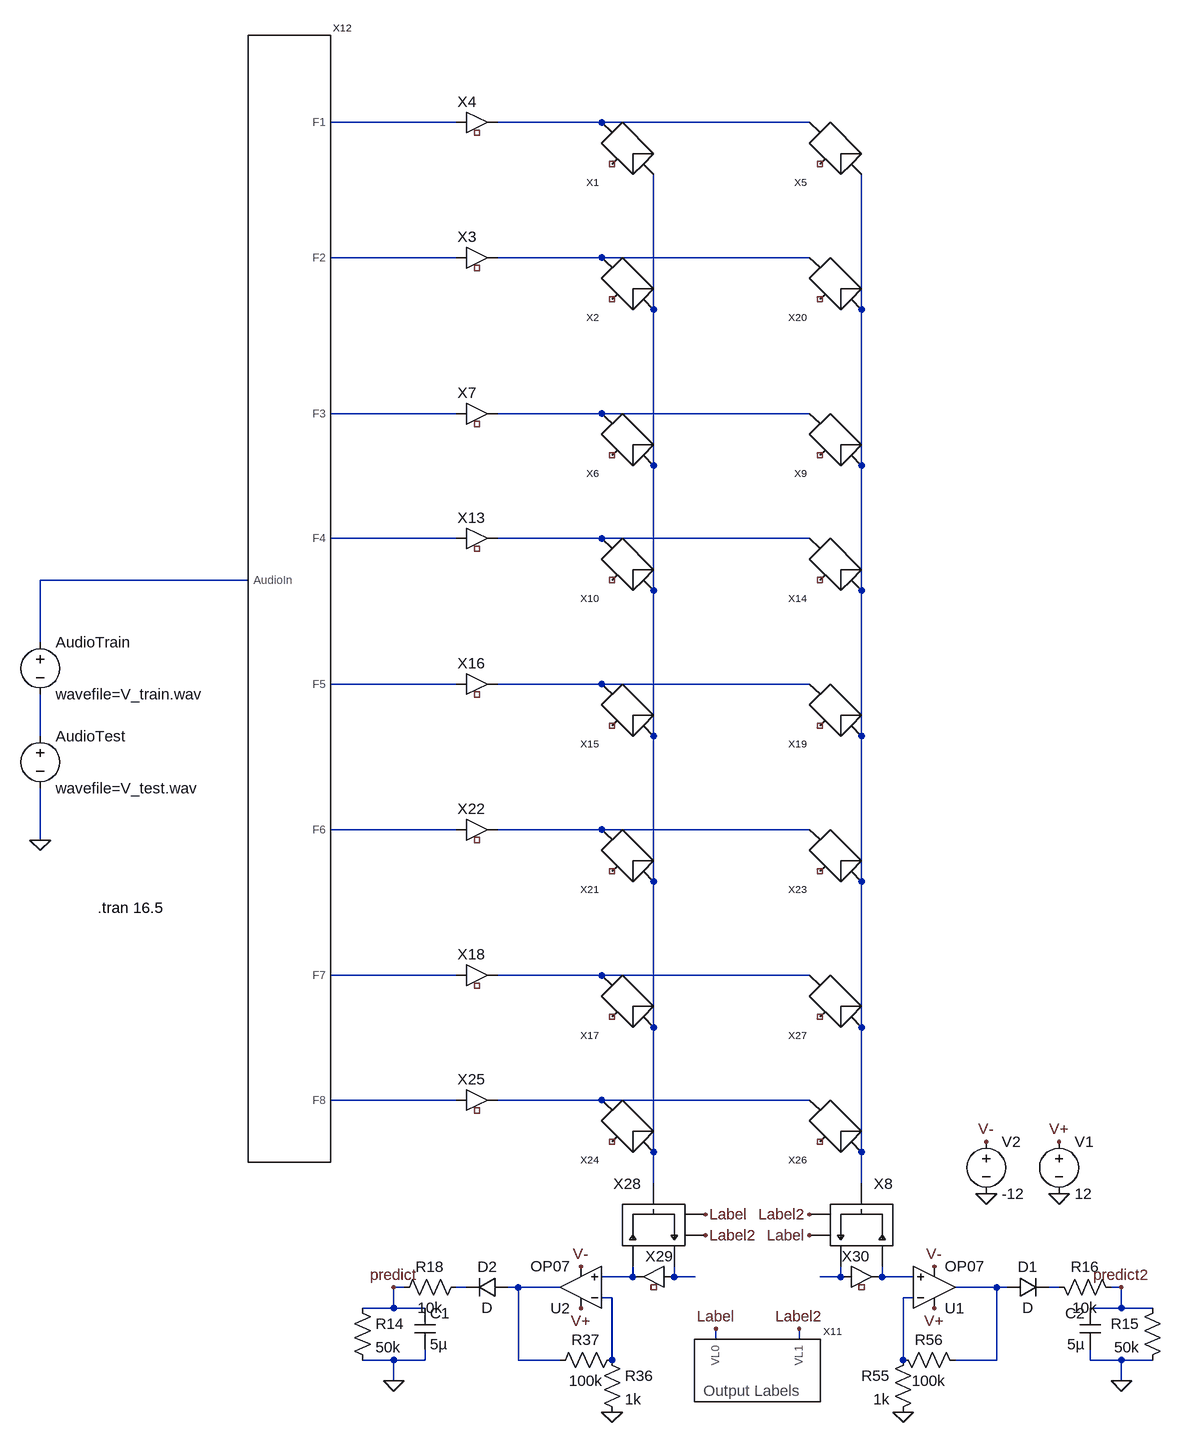
[diagram p0: schematic Net Array_Small.asc]
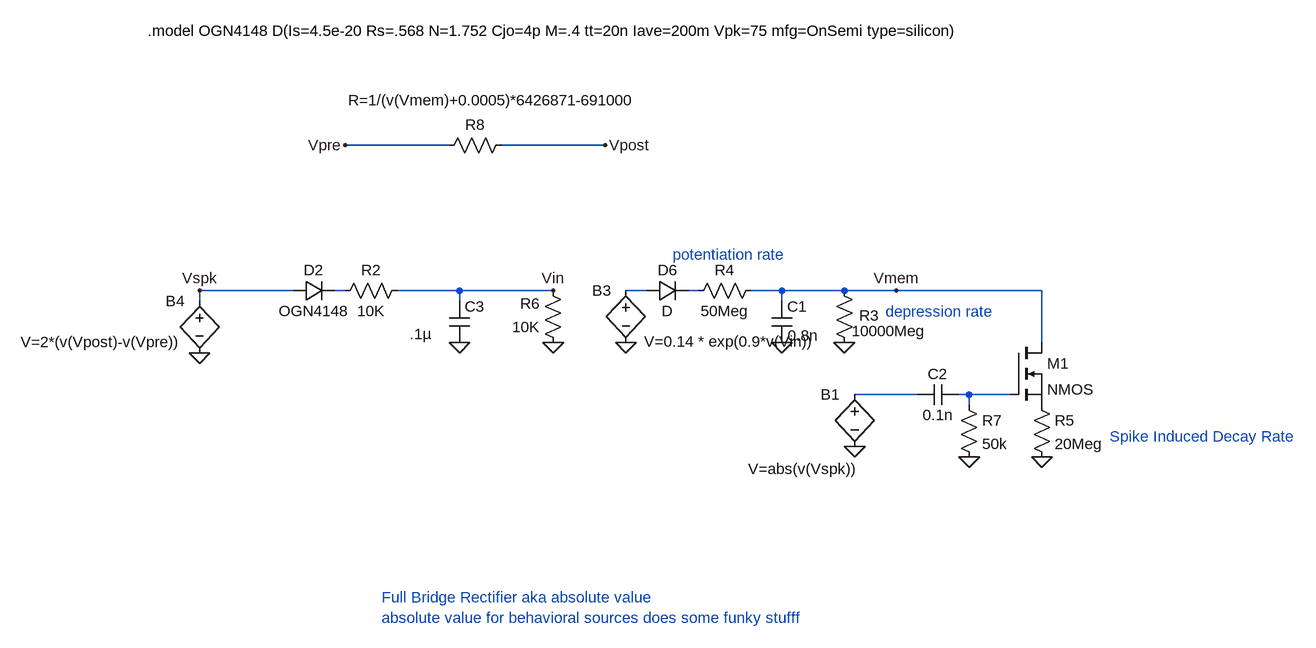
[diagram p1: sub-circuit synapse.asc]
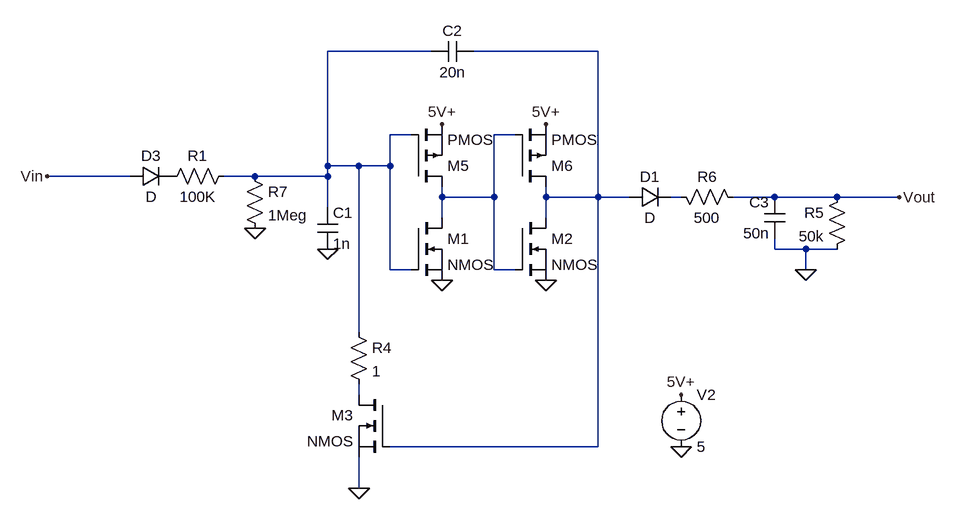
[diagram p2: sub-circuit ahp.asc]
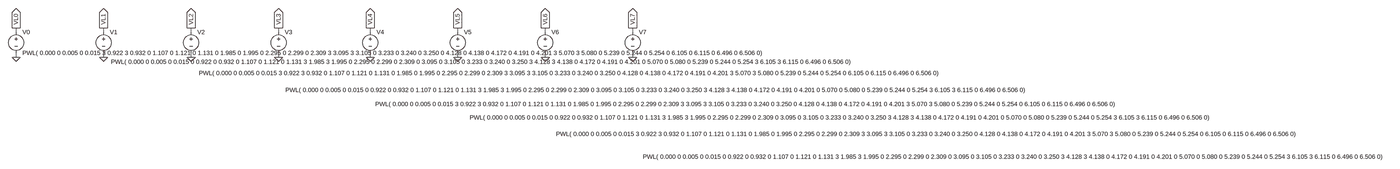
[diagram p3: sub-circuit outputlabels.asc, whole sheet]
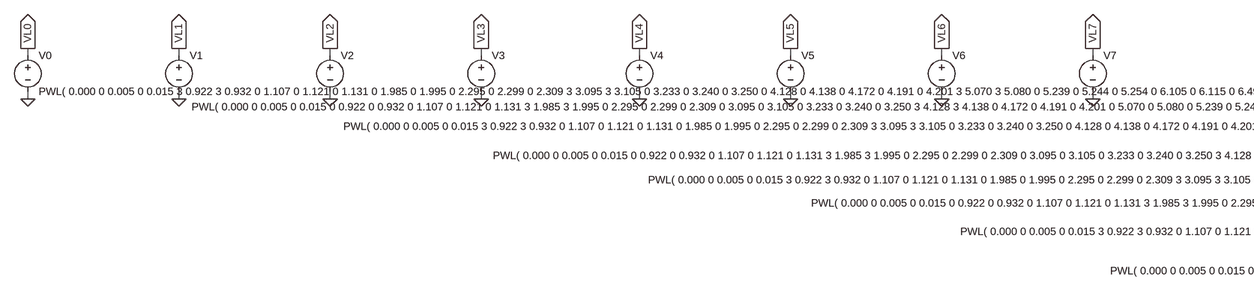
[diagram p4: sub-circuit outputlabels.asc, part, row 1 of 1, column 1 of 2]
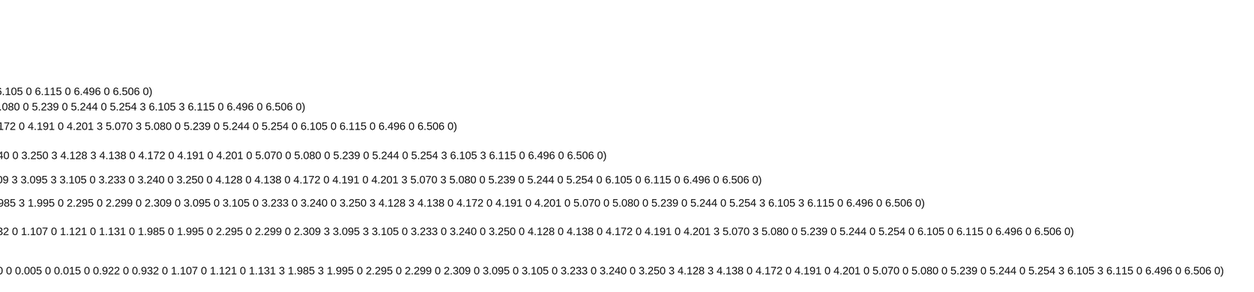
[diagram p5: sub-circuit outputlabels.asc, part, row 1 of 1, column 2 of 2]
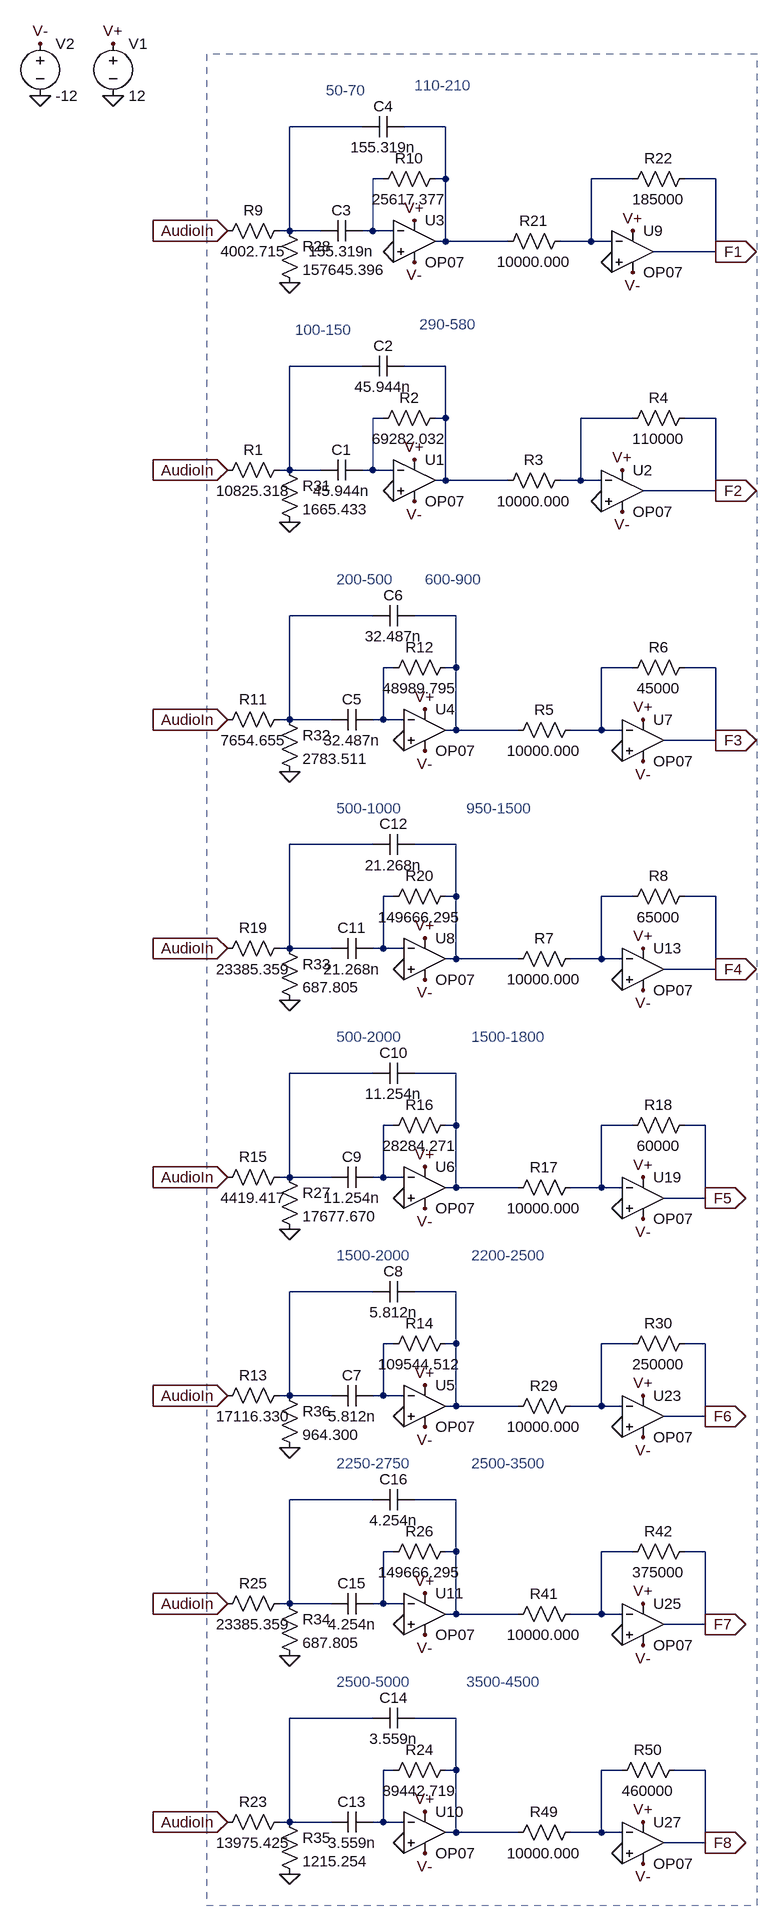
[diagram p6: sub-circuit filterbank.asc]
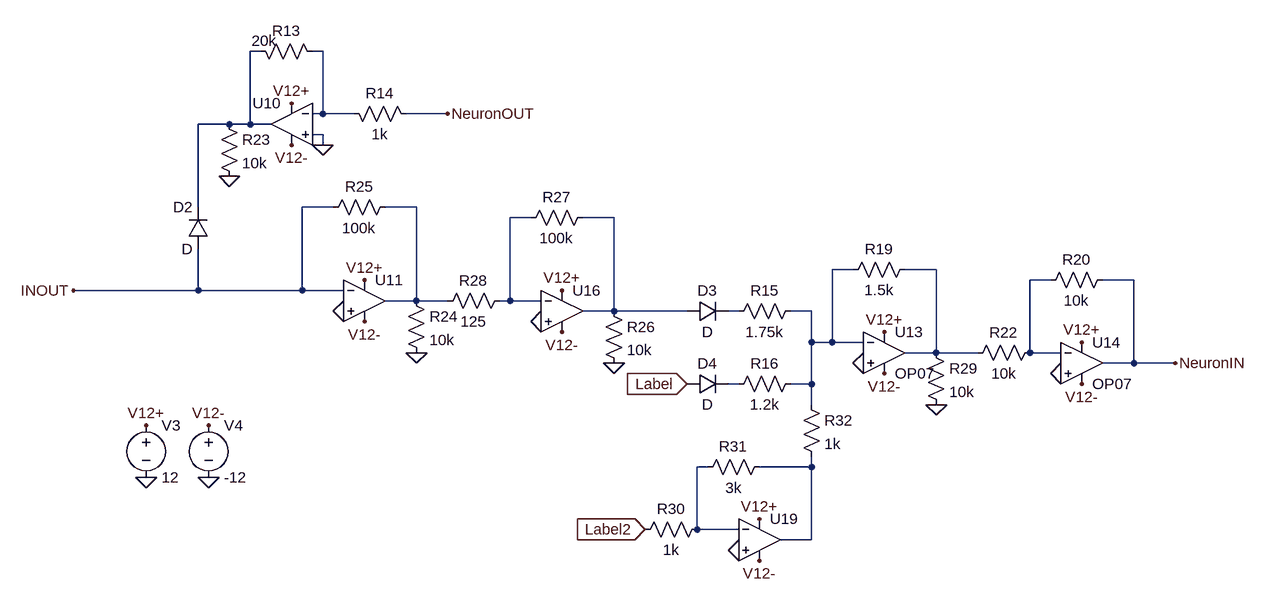
[diagram p7: sub-circuit bidirectionlamp.asc]
Net Array_Small.asc, the LTspice schematic file:
Version 4
SHEET 1 5076 1460
WIRE 96 -1024 -96 -1024
WIRE 320 -1024 160 -1024
WIRE 640 -1024 320 -1024
WIRE 96 -816 -96 -816
WIRE 320 -816 160 -816
WIRE 640 -816 320 -816
WIRE 400 -736 400 -944
WIRE 720 -736 720 -944
WIRE 96 -576 -96 -576
WIRE 320 -576 160 -576
WIRE 640 -576 320 -576
WIRE 400 -496 400 -736
WIRE 720 -496 720 -736
WIRE 96 -384 -96 -384
WIRE 320 -384 160 -384
WIRE 640 -384 320 -384
WIRE -224 -320 -544 -320
WIRE 400 -304 400 -496
WIRE 720 -304 720 -496
WIRE -544 -224 -544 -320
WIRE 96 -160 -96 -160
WIRE 320 -160 160 -160
WIRE 640 -160 320 -160
WIRE -544 -80 -544 -144
WIRE 400 -80 400 -304
WIRE 720 -80 720 -304
WIRE 96 64 -96 64
WIRE 320 64 160 64
WIRE 640 64 320 64
WIRE -544 80 -544 0
WIRE 400 144 400 -80
WIRE 720 144 720 -80
WIRE 96 288 -96 288
WIRE 320 288 160 288
WIRE 640 288 320 288
WIRE 400 368 400 144
WIRE 720 368 720 144
WIRE 96 480 -96 480
WIRE 320 480 160 480
WIRE 640 480 320 480
WIRE 400 560 400 368
WIRE 720 560 720 368
WIRE 400 608 400 560
WIRE 720 608 720 560
WIRE 368 752 368 736
WIRE 368 752 320 752
WIRE 432 752 432 736
WIRE 464 752 432 752
WIRE 688 752 688 736
WIRE 688 752 656 752
WIRE 752 752 752 736
WIRE 800 752 752 752
WIRE 16 768 0 768
WIRE 112 768 96 768
WIRE 192 768 176 768
WIRE 256 768 192 768
WIRE 928 768 864 768
WIRE 944 768 928 768
WIRE 1024 768 1008 768
WIRE 1120 768 1104 768
WIRE 336 784 320 784
WIRE 800 784 784 784
WIRE 0 800 0 768
WIRE 0 800 -48 800
WIRE 48 800 0 800
WIRE 1120 800 1120 768
WIRE 1120 800 1072 800
WIRE 1168 800 1120 800
WIRE 496 848 496 832
WIRE 624 848 624 832
WIRE 0 880 -48 880
WIRE 48 880 48 864
WIRE 48 880 0 880
WIRE 192 880 192 768
WIRE 256 880 192 880
WIRE 336 880 336 784
WIRE 784 880 784 784
WIRE 928 880 928 768
WIRE 928 880 864 880
WIRE 1072 880 1072 864
WIRE 1120 880 1072 880
WIRE 1168 880 1120 880
WIRE 0 912 0 880
WIRE 1120 912 1120 880
FLAG -544 80 0
FLAG 912 624 0
FLAG 1024 624 0
FLAG 1024 544 V+
FLAG 912 544 V-
FLAG 0 912 0
FLAG 288 800 V+
FLAG 288 736 V-
FLAG 496 832 Label
FLAG 336 960 0
FLAG 624 832 Label2
FLAG 1120 912 0
FLAG 832 800 V+
FLAG 832 736 V-
FLAG 784 960 0
FLAG 0 768 predict
FLAG 1120 768 predict2
FLAG 480 656 Label
FLAG 640 688 Label
FLAG 480 688 Label2
FLAG 640 656 Label2
SYMBOL Synapse 400 -736 R180
SYMATTR InstName X2
SYMBOL AHP 96 -816 R0
SYMATTR InstName X3
SYMATTR SpiceLine Rinhibition = 1Meg
SYMBOL Synapse 400 368 R180
SYMATTR InstName X17
SYMBOL AHP 96 288 R0
SYMATTR InstName X18
SYMATTR SpiceLine Rinhibition = 1Meg
SYMBOL Synapse 720 -736 R180
SYMATTR InstName X20
SYMBOL Synapse 720 368 R180
SYMATTR InstName X27
SYMBOL OutputLabels 464 944 R0
SYMATTR InstName X11
SYMBOL voltage -544 -240 R0
SYMATTR InstName AudioTrain
SYMATTR Value wavefile=V_train.wav
SYMBOL voltage -544 -96 R0
SYMATTR InstName AudioTest
SYMATTR Value wavefile=V_test.wav
SYMBOL FilterBank -224 576 R0
SYMATTR InstName X12
SYMBOL voltage 1024 528 R0
WINDOW 123 0 0 Left 2
WINDOW 39 0 0 Left 2
SYMATTR InstName V1
SYMATTR Value 12
SYMBOL voltage 912 528 R0
WINDOW 123 0 0 Left 2
WINDOW 39 0 0 Left 2
SYMATTR InstName V2
SYMATTR Value -12
SYMBOL res -64 784 R0
SYMATTR InstName R14
SYMATTR Value 50k
SYMBOL cap 32 800 R0
SYMATTR InstName C1
SYMATTR Value 5µ
SYMBOL Opamps\\OP07 288 832 R180
SYMATTR InstName U2
SYMBOL diode 176 752 R90
WINDOW 0 0 32 VBottom 2
WINDOW 3 32 32 VTop 2
SYMATTR InstName D2
SYMBOL res 112 752 R90
WINDOW 0 0 56 VBottom 2
WINDOW 3 32 56 VTop 2
SYMATTR InstName R18
SYMATTR Value 10k
SYMBOL Synapse 400 -944 R180
SYMATTR InstName X1
SYMBOL AHP 96 -1024 R0
SYMATTR InstName X4
SYMATTR SpiceLine Rinhibition = 1Meg
SYMBOL Synapse 720 -944 R180
SYMATTR InstName X5
SYMBOL Synapse 400 -496 R180
SYMATTR InstName X6
SYMBOL AHP 96 -576 R0
SYMATTR InstName X7
SYMATTR SpiceLine Rinhibition = 1Meg
SYMBOL Synapse 720 -496 R180
SYMATTR InstName X9
SYMBOL Synapse 400 -304 R180
SYMATTR InstName X10
SYMBOL AHP 96 -384 R0
SYMATTR InstName X13
SYMATTR SpiceLine Rinhibition = 1Meg
SYMBOL Synapse 720 -304 R180
SYMATTR InstName X14
SYMBOL Synapse 400 -80 R180
SYMATTR InstName X15
SYMBOL AHP 96 -160 R0
SYMATTR InstName X16
SYMATTR SpiceLine Rinhibition = 1Meg
SYMBOL Synapse 720 -80 R180
SYMATTR InstName X19
SYMBOL Synapse 400 144 R180
SYMATTR InstName X21
SYMBOL AHP 96 64 R0
SYMATTR InstName X22
SYMATTR SpiceLine Rinhibition = 1Meg
SYMBOL Synapse 720 144 R180
SYMATTR InstName X23
SYMBOL Synapse 400 560 R180
SYMATTR InstName X24
SYMBOL AHP 96 480 R0
SYMATTR InstName X25
SYMATTR SpiceLine Rinhibition = 1Meg
SYMBOL Synapse 720 560 R180
SYMATTR InstName X26
SYMBOL res 320 864 R0
SYMATTR InstName R36
SYMATTR Value 1k
SYMBOL res 352 864 R90
WINDOW 0 0 56 VBottom 2
WINDOW 3 32 56 VTop 2
SYMATTR InstName R37
SYMATTR Value 100k
SYMBOL res 1184 784 M0
SYMATTR InstName R15
SYMATTR Value 50k
SYMBOL cap 1088 800 M0
SYMATTR InstName C2
SYMATTR Value 5µ
SYMBOL Opamps\\OP07 832 832 M180
SYMATTR InstName U1
SYMBOL diode 944 752 M90
WINDOW 0 0 32 VBottom 2
WINDOW 3 32 32 VTop 2
SYMATTR InstName D1
SYMBOL res 1008 752 M90
WINDOW 0 0 56 VBottom 2
WINDOW 3 32 56 VTop 2
SYMATTR InstName R16
SYMATTR Value 10k
SYMBOL res 800 864 M0
SYMATTR InstName R55
SYMATTR Value 1k
SYMBOL res 768 864 M90
WINDOW 0 0 56 VBottom 2
WINDOW 3 32 56 VTop 2
SYMATTR InstName R56
SYMATTR Value 100k
SYMBOL BiDirectionlAmp 720 672 R0
SYMATTR InstName X8
SYMBOL AHP 432 752 M0
SYMATTR InstName X29
SYMATTR SpiceLine Rinhibition = 1Meg
SYMBOL AHP 688 752 R0
SYMATTR InstName X30
SYMATTR SpiceLine Rinhibition = 1Meg
SYMBOL BiDirectionlAmp 400 672 M0
SYMATTR InstName X28
TEXT -456 184 Left 2 !.tran 16.5

synapse.asc, the sub-circuit schematic file:
Version 4
SHEET 1 2576 1444
WIRE 336 416 176 416
WIRE 576 416 416 416
WIRE 96 640 -48 640
WIRE 176 640 160 640
WIRE 352 640 256 640
WIRE 496 640 352 640
WIRE 640 640 608 640
WIRE 720 640 704 640
WIRE 848 640 800 640
WIRE 944 640 848 640
WIRE 1024 640 944 640
WIRE 1248 640 1024 640
WIRE -48 656 -48 640
WIRE 352 656 352 640
WIRE 848 656 848 640
WIRE 1248 720 1248 640
WIRE 1056 800 960 800
WIRE 1136 800 1120 800
WIRE 1200 800 1136 800
WIRE 1136 816 1136 800
FLAG -48 736 0
FLAG 176 416 Vpre
FLAG 576 416 Vpost
FLAG 352 720 0
FLAG 496 720 0
FLAG 496 640 Vin
FLAG -48 640 Vspk
FLAG 960 880 0
FLAG 944 720 0
FLAG 848 720 0
FLAG 608 720 0
FLAG 1248 896 0
FLAG 1136 896 0
FLAG 1024 640 Vmem
SYMBOL res 512 736 R180
WINDOW 0 36 76 Left 2
WINDOW 3 36 40 Left 2
SYMATTR InstName R6
SYMATTR Value 10K
SYMBOL bv -48 640 R0
WINDOW 0 -52 16 Left 2
WINDOW 3 -275 79 Left 2
SYMATTR InstName B4
SYMATTR Value V=2*(v(Vpost)-v(Vpre))
SYMBOL res 432 400 R90
WINDOW 0 0 56 VBottom 2
WINDOW 3 -69 27 VTop 2
SYMATTR InstName R8
SYMATTR Value R=1/(v(Vmem)+0.0005)*6426871-691000
SYMBOL cap 336 656 R0
WINDOW 3 -61 51 Left 2
SYMATTR Value .1µ
SYMATTR InstName C3
SYMATTR SpiceLine V=16 Irms=7.41 Rser=0.000 Lser=0
SYMBOL diode 96 656 R270
WINDOW 0 32 32 VTop 2
WINDOW 3 0 32 VBottom 2
SYMATTR InstName D2
SYMATTR Value OGN4148
SYMBOL res 272 624 R90
WINDOW 0 0 56 VBottom 2
WINDOW 3 32 56 VTop 2
SYMATTR InstName R2
SYMATTR Value 10K
SYMBOL bv 960 784 R0
WINDOW 0 -52 16 Left 2
WINDOW 3 -164 130 Left 2
SYMATTR InstName B1
SYMATTR Value V=abs(v(Vspk))
SYMBOL cap 832 656 R0
WINDOW 3 25 53 Left 2
SYMATTR Value 0.8n
SYMATTR InstName C1
SYMATTR SpiceLine V=16 Irms=7.41 Rser=0.000 Lser=0
SYMBOL res 960 736 R180
WINDOW 0 -38 58 Left 2
WINDOW 3 -110 34 Left 2
SYMATTR InstName R3
SYMATTR Value 10000Meg
SYMBOL res 816 624 R90
WINDOW 0 0 56 VBottom 2
WINDOW 3 32 56 VTop 2
SYMATTR InstName R4
SYMATTR Value 50Meg
SYMBOL bv 608 624 R0
WINDOW 0 -52 16 Left 2
WINDOW 3 28 94 Left 2
SYMATTR InstName B3
SYMATTR Value V=0.14 * exp(0.9*v(Vin))
SYMBOL nmos 1200 720 R0
SYMATTR InstName M1
SYMBOL res 1232 800 R0
SYMATTR InstName R5
SYMATTR Value 20Meg
SYMBOL cap 1120 784 R90
WINDOW 0 0 32 VBottom 2
WINDOW 3 32 32 VTop 2
SYMATTR InstName C2
SYMATTR Value 0.1n
SYMBOL res 1120 800 R0
SYMATTR InstName R7
SYMATTR Value 50k
SYMBOL diode 640 656 R270
WINDOW 0 32 32 VTop 2
WINDOW 3 0 32 VBottom 2
SYMATTR InstName D6
TEXT -128 240 Left 2 !.model OGN4148 D(Is=4.5e-20 Rs=.568 N=1.752 Cjo=4p M=.4 tt=20n Iave=200m Vpk=75 mfg=OnSemi type=silicon)
TEXT 680 584 Left 2 ;potentiation rate
TEXT 1008 672 Left 2 ;depression rate
TEXT 1352 864 Left 2 ;Spike Induced Decay Rate
TEXT 232 1112 Left 2 ;Full Bridge Rectifier aka absolute value\nabsolute value for behavioral sources does some funky stufff

ahp.asc, the sub-circuit schematic file:
Version 4
SHEET 1 1244 680
WIRE 384 -144 224 -144
WIRE 640 -144 448 -144
WIRE 352 -16 320 -16
WIRE 512 -16 480 -16
WIRE 224 32 224 -144
WIRE 272 32 224 32
WIRE 320 32 320 -16
WIRE 320 32 272 32
WIRE -80 48 -208 48
WIRE 112 48 64 48
WIRE 224 48 224 32
WIRE 224 48 112 48
WIRE 400 80 400 64
WIRE 480 80 480 -16
WIRE 480 80 400 80
WIRE 560 80 560 64
WIRE 640 80 640 -144
WIRE 640 80 560 80
WIRE 688 80 640 80
WIRE 768 80 752 80
WIRE 912 80 848 80
WIRE 1008 80 912 80
WIRE 1104 80 1008 80
WIRE 224 96 224 48
WIRE 400 112 400 80
WIRE 560 112 560 80
WIRE 912 160 912 144
WIRE 960 160 912 160
WIRE 1008 160 960 160
WIRE 320 192 320 32
WIRE 352 192 320 192
WIRE 480 192 480 80
WIRE 512 192 480 192
WIRE 960 192 960 160
WIRE 272 288 272 32
WIRE 272 384 272 368
WIRE 640 464 640 80
WIRE 640 464 320 464
WIRE 272 528 272 480
FLAG 768 464 0
FLAG 768 384 5V+
FLAG 224 160 0
FLAG 400 -32 5V+
FLAG 560 -32 5V+
FLAG 560 208 0
FLAG 400 208 0
FLAG 272 528 0
FLAG -208 48 Vin
FLAG 1104 80 Vout
FLAG 960 192 0
FLAG 112 128 0
SYMBOL res 80 32 R90
WINDOW 0 0 56 VBottom 2
WINDOW 3 32 56 VTop 2
SYMATTR InstName R1
SYMATTR Value 100K
SYMBOL cap 208 96 R0
SYMATTR InstName C1
SYMATTR Value 1n
SYMBOL cap 448 -160 R90
WINDOW 0 0 32 VBottom 2
WINDOW 3 32 32 VTop 2
SYMATTR InstName C2
SYMATTR Value 20n
SYMBOL voltage 768 368 R0
WINDOW 123 0 0 Left 2
WINDOW 39 0 0 Left 2
SYMATTR InstName V2
SYMATTR Value 5
SYMBOL nmos 320 384 M0
SYMATTR InstName M3
SYMBOL nmos 352 112 R0
SYMATTR InstName M1
SYMBOL nmos 512 112 R0
SYMATTR InstName M2
SYMBOL pmos 352 64 M180
SYMATTR InstName M5
SYMBOL pmos 512 64 M180
SYMATTR InstName M6
SYMBOL diode -80 64 R270
WINDOW 0 32 32 VTop 2
WINDOW 3 0 32 VBottom 2
SYMATTR InstName D3
SYMBOL res 256 272 R0
SYMATTR InstName R4
SYMATTR Value 1
SYMBOL res 1024 64 M0
SYMATTR InstName R5
SYMATTR Value 50k
SYMBOL cap 928 80 M0
SYMATTR InstName C3
SYMATTR Value 50n
SYMBOL res 752 64 M90
WINDOW 0 0 56 VBottom 2
WINDOW 3 32 56 VTop 2
SYMATTR InstName R6
SYMATTR Value 500
SYMBOL diode 688 96 R270
WINDOW 0 32 32 VTop 2
WINDOW 3 0 32 VBottom 2
SYMATTR InstName D1
SYMBOL res 96 32 R0
SYMATTR InstName R7
SYMATTR Value 1Meg

outputlabels.asc, the sub-circuit schematic file:
Version 4
SHEET 1 2720 680
WIRE 64 64 64 48
WIRE 400 64 400 48
WIRE 736 64 736 48
WIRE 1072 64 1072 48
WIRE 1424 64 1424 48
WIRE 1760 64 1760 48
WIRE 2096 64 2096 48
WIRE 2432 64 2432 48
WIRE 64 160 64 144
WIRE 400 160 400 144
WIRE 736 160 736 144
WIRE 1072 160 1072 144
WIRE 1424 160 1424 144
WIRE 1760 160 1760 144
WIRE 2096 160 2096 144
WIRE 2432 160 2432 144
FLAG 64 48 VL0
IOPIN 64 48 Out
FLAG 64 160 0
FLAG 400 48 VL1
IOPIN 400 48 Out
FLAG 400 160 0
FLAG 736 48 VL2
IOPIN 736 48 Out
FLAG 736 160 0
FLAG 1072 48 VL3
IOPIN 1072 48 Out
FLAG 1072 160 0
FLAG 1424 48 VL4
IOPIN 1424 48 Out
FLAG 1424 160 0
FLAG 1760 48 VL5
IOPIN 1760 48 Out
FLAG 1760 160 0
FLAG 2096 48 VL6
IOPIN 2096 48 Out
FLAG 2096 160 0
FLAG 2432 48 VL7
IOPIN 2432 48 Out
FLAG 2432 160 0
SYMBOL voltage 64 48 R0
WINDOW 123 0 0 Left 2
WINDOW 39 0 0 Left 2
SYMATTR InstName V0
SYMATTR Value PWL( 0.000 0 0.005 0 0.015 3 0.922 3 0.932 0 1.107 0 1.121 0 1.131 0 1.985 0 1.995 0 2.295 0 2.299 0 2.309 3 3.095 3 3.105 0 3.233 0 3.240 0 3.250 0 4.128 0 4.138 0 4.172 0 4.191 0 4.201 3 5.070 3 5.080 0 5.239 0 5.244 0 5.254 0 6.105 0 6.115 0 6.496 0 6.506 0)
SYMBOL voltage 400 48 R0
WINDOW 123 0 0 Left 2
WINDOW 39 0 0 Left 2
WINDOW 3 28 130 Left 2
SYMATTR InstName V1
SYMATTR Value PWL( 0.000 0 0.005 0 0.015 0 0.922 0 0.932 0 1.107 0 1.121 0 1.131 3 1.985 3 1.995 0 2.295 0 2.299 0 2.309 0 3.095 0 3.105 0 3.233 0 3.240 0 3.250 3 4.128 3 4.138 0 4.172 0 4.191 0 4.201 0 5.070 0 5.080 0 5.239 0 5.244 0 5.254 3 6.105 3 6.115 0 6.496 0 6.506 0)
SYMBOL voltage 736 48 R0
WINDOW 123 0 0 Left 2
WINDOW 39 0 0 Left 2
WINDOW 3 30 173 Left 2
SYMATTR InstName V2
SYMATTR Value PWL( 0.000 0 0.005 0 0.015 3 0.922 3 0.932 0 1.107 0 1.121 0 1.131 0 1.985 0 1.995 0 2.295 0 2.299 0 2.309 3 3.095 3 3.105 0 3.233 0 3.240 0 3.250 0 4.128 0 4.138 0 4.172 0 4.191 0 4.201 3 5.070 3 5.080 0 5.239 0 5.244 0 5.254 0 6.105 0 6.115 0 6.496 0 6.506 0)
SYMBOL voltage 1072 48 R0
WINDOW 123 0 0 Left 2
WINDOW 39 0 0 Left 2
WINDOW 3 26 238 Left 2
SYMATTR InstName V3
SYMATTR Value PWL( 0.000 0 0.005 0 0.015 0 0.922 0 0.932 0 1.107 0 1.121 0 1.131 3 1.985 3 1.995 0 2.295 0 2.299 0 2.309 0 3.095 0 3.105 0 3.233 0 3.240 0 3.250 3 4.128 3 4.138 0 4.172 0 4.191 0 4.201 0 5.070 0 5.080 0 5.239 0 5.244 0 5.254 3 6.105 3 6.115 0 6.496 0 6.506 0)
SYMBOL voltage 1424 48 R0
WINDOW 123 0 0 Left 2
WINDOW 39 0 0 Left 2
WINDOW 3 19 292 Left 2
SYMATTR InstName V4
SYMATTR Value PWL( 0.000 0 0.005 0 0.015 3 0.922 3 0.932 0 1.107 0 1.121 0 1.131 0 1.985 0 1.995 0 2.295 0 2.299 0 2.309 3 3.095 3 3.105 0 3.233 0 3.240 0 3.250 0 4.128 0 4.138 0 4.172 0 4.191 0 4.201 3 5.070 3 5.080 0 5.239 0 5.244 0 5.254 0 6.105 0 6.115 0 6.496 0 6.506 0)
SYMBOL voltage 1760 48 R0
WINDOW 123 0 0 Left 2
WINDOW 39 0 0 Left 2
WINDOW 3 46 344 Left 2
SYMATTR InstName V5
SYMATTR Value PWL( 0.000 0 0.005 0 0.015 0 0.922 0 0.932 0 1.107 0 1.121 0 1.131 3 1.985 3 1.995 0 2.295 0 2.299 0 2.309 0 3.095 0 3.105 0 3.233 0 3.240 0 3.250 3 4.128 3 4.138 0 4.172 0 4.191 0 4.201 0 5.070 0 5.080 0 5.239 0 5.244 0 5.254 3 6.105 3 6.115 0 6.496 0 6.506 0)
SYMBOL voltage 2096 48 R0
WINDOW 123 0 0 Left 2
WINDOW 39 0 0 Left 2
WINDOW 3 41 407 Left 2
SYMATTR InstName V6
SYMATTR Value PWL( 0.000 0 0.005 0 0.015 3 0.922 3 0.932 0 1.107 0 1.121 0 1.131 0 1.985 0 1.995 0 2.295 0 2.299 0 2.309 3 3.095 3 3.105 0 3.233 0 3.240 0 3.250 0 4.128 0 4.138 0 4.172 0 4.191 0 4.201 3 5.070 3 5.080 0 5.239 0 5.244 0 5.254 0 6.105 0 6.115 0 6.496 0 6.506 0)
SYMBOL voltage 2432 48 R0
WINDOW 123 0 0 Left 2
WINDOW 39 0 0 Left 2
WINDOW 3 39 495 Left 2
SYMATTR InstName V7
SYMATTR Value PWL( 0.000 0 0.005 0 0.015 0 0.922 0 0.932 0 1.107 0 1.121 0 1.131 3 1.985 3 1.995 0 2.295 0 2.299 0 2.309 0 3.095 0 3.105 0 3.233 0 3.240 0 3.250 3 4.128 3 4.138 0 4.172 0 4.191 0 4.201 0 5.070 0 5.080 0 5.239 0 5.244 0 5.254 3 6.105 3 6.115 0 6.496 0 6.506 0)

filterbank.asc, the sub-circuit schematic file:
Version 4
SHEET 1 3812 1988
WIRE -704 -2016 -816 -2016
WIRE -576 -2016 -640 -2016
WIRE -672 -1936 -688 -1936
WIRE -576 -1936 -576 -2016
WIRE -576 -1936 -592 -1936
WIRE -288 -1936 -352 -1936
WIRE -160 -1936 -208 -1936
WIRE -816 -1856 -816 -2016
WIRE -816 -1856 -832 -1856
WIRE -768 -1856 -816 -1856
WIRE -688 -1856 -688 -1936
WIRE -688 -1856 -704 -1856
WIRE -656 -1856 -688 -1856
WIRE -576 -1840 -576 -1936
WIRE -576 -1840 -592 -1840
WIRE -480 -1840 -576 -1840
WIRE -352 -1840 -352 -1936
WIRE -352 -1840 -400 -1840
WIRE -320 -1840 -352 -1840
WIRE -160 -1824 -160 -1936
WIRE -160 -1824 -256 -1824
WIRE -704 -1648 -816 -1648
WIRE -576 -1648 -640 -1648
WIRE -672 -1568 -688 -1568
WIRE -576 -1568 -576 -1648
WIRE -576 -1568 -592 -1568
WIRE -288 -1568 -368 -1568
WIRE -160 -1568 -208 -1568
WIRE -816 -1488 -816 -1648
WIRE -816 -1488 -832 -1488
WIRE -768 -1488 -816 -1488
WIRE -688 -1488 -688 -1568
WIRE -688 -1488 -704 -1488
WIRE -656 -1488 -688 -1488
WIRE -576 -1472 -576 -1568
WIRE -576 -1472 -592 -1472
WIRE -480 -1472 -576 -1472
WIRE -368 -1472 -368 -1568
WIRE -368 -1472 -400 -1472
WIRE -336 -1472 -368 -1472
WIRE -160 -1456 -160 -1568
WIRE -160 -1456 -272 -1456
WIRE -688 -1264 -816 -1264
WIRE -560 -1264 -624 -1264
WIRE -656 -1184 -672 -1184
WIRE -560 -1184 -560 -1264
WIRE -560 -1184 -576 -1184
WIRE -288 -1184 -336 -1184
WIRE -160 -1184 -208 -1184
WIRE -816 -1104 -816 -1264
WIRE -816 -1104 -832 -1104
WIRE -752 -1104 -816 -1104
WIRE -672 -1104 -672 -1184
WIRE -672 -1104 -688 -1104
WIRE -640 -1104 -672 -1104
WIRE -560 -1088 -560 -1184
WIRE -560 -1088 -576 -1088
WIRE -464 -1088 -560 -1088
WIRE -336 -1088 -336 -1184
WIRE -336 -1088 -384 -1088
WIRE -304 -1088 -336 -1088
WIRE -160 -1072 -160 -1184
WIRE -160 -1072 -240 -1072
WIRE -688 -912 -816 -912
WIRE -560 -912 -624 -912
WIRE -656 -832 -672 -832
WIRE -560 -832 -560 -912
WIRE -560 -832 -576 -832
WIRE -288 -832 -336 -832
WIRE -160 -832 -208 -832
WIRE -816 -752 -816 -912
WIRE -816 -752 -832 -752
WIRE -752 -752 -816 -752
WIRE -672 -752 -672 -832
WIRE -672 -752 -688 -752
WIRE -640 -752 -672 -752
WIRE -560 -736 -560 -832
WIRE -560 -736 -576 -736
WIRE -464 -736 -560 -736
WIRE -336 -736 -336 -832
WIRE -336 -736 -384 -736
WIRE -304 -736 -336 -736
WIRE -160 -720 -160 -832
WIRE -160 -720 -240 -720
WIRE -688 -560 -816 -560
WIRE -560 -560 -624 -560
WIRE -656 -480 -672 -480
WIRE -560 -480 -560 -560
WIRE -560 -480 -576 -480
WIRE -288 -480 -336 -480
WIRE -176 -480 -208 -480
WIRE -816 -400 -816 -560
WIRE -816 -400 -832 -400
WIRE -752 -400 -816 -400
WIRE -672 -400 -672 -480
WIRE -672 -400 -688 -400
WIRE -640 -400 -672 -400
WIRE -560 -384 -560 -480
WIRE -560 -384 -576 -384
WIRE -464 -384 -560 -384
WIRE -336 -384 -336 -480
WIRE -336 -384 -384 -384
WIRE -304 -384 -336 -384
WIRE -176 -368 -176 -480
WIRE -176 -368 -240 -368
WIRE -688 -224 -816 -224
WIRE -560 -224 -624 -224
WIRE -656 -144 -672 -144
WIRE -560 -144 -560 -224
WIRE -560 -144 -576 -144
WIRE -288 -144 -336 -144
WIRE -176 -144 -208 -144
WIRE -816 -64 -816 -224
WIRE -816 -64 -832 -64
WIRE -752 -64 -816 -64
WIRE -672 -64 -672 -144
WIRE -672 -64 -688 -64
WIRE -640 -64 -672 -64
WIRE -560 -48 -560 -144
WIRE -560 -48 -576 -48
WIRE -464 -48 -560 -48
WIRE -336 -48 -336 -144
WIRE -336 -48 -384 -48
WIRE -304 -48 -336 -48
WIRE -176 -32 -176 -144
WIRE -176 -32 -240 -32
WIRE -688 96 -816 96
WIRE -560 96 -624 96
WIRE -656 176 -672 176
WIRE -560 176 -560 96
WIRE -560 176 -576 176
WIRE -288 176 -336 176
WIRE -176 176 -208 176
WIRE -816 256 -816 96
WIRE -816 256 -832 256
WIRE -752 256 -816 256
WIRE -672 256 -672 176
WIRE -672 256 -688 256
WIRE -640 256 -672 256
WIRE -560 272 -560 176
WIRE -560 272 -576 272
WIRE -464 272 -560 272
WIRE -336 272 -336 176
WIRE -336 272 -384 272
WIRE -304 272 -336 272
WIRE -176 288 -176 176
WIRE -176 288 -240 288
WIRE -688 432 -816 432
WIRE -560 432 -624 432
WIRE -656 512 -672 512
WIRE -560 512 -560 432
WIRE -560 512 -576 512
WIRE -304 512 -336 512
WIRE -176 512 -224 512
WIRE -816 592 -816 432
WIRE -816 592 -832 592
WIRE -752 592 -816 592
WIRE -672 592 -672 512
WIRE -672 592 -688 592
WIRE -640 592 -672 592
WIRE -560 608 -560 512
WIRE -560 608 -576 608
WIRE -464 608 -560 608
WIRE -336 608 -336 512
WIRE -336 608 -384 608
WIRE -304 608 -336 608
WIRE -176 624 -176 512
WIRE -176 624 -240 624
FLAG -288 -1856 V+
FLAG -288 -1792 V-
FLAG -160 -1824 F1
IOPIN -160 -1824 Out
FLAG -176 -368 F5
IOPIN -176 -368 Out
FLAG -176 -32 F6
IOPIN -176 -32 Out
FLAG -160 -1456 F2
IOPIN -160 -1456 Out
FLAG -160 -1072 F3
IOPIN -160 -1072 Out
FLAG -176 624 F8
IOPIN -176 624 Out
FLAG -160 -720 F4
IOPIN -160 -720 Out
FLAG -176 288 F7
IOPIN -176 288 Out
FLAG -320 -1808 0
FLAG -304 -1488 V+
FLAG -304 -1424 V-
FLAG -336 -1440 0
FLAG -272 -1104 V+
FLAG -272 -1040 V-
FLAG -304 -1056 0
FLAG -272 -752 V+
FLAG -272 -688 V-
FLAG -304 -704 0
FLAG -272 -400 V+
FLAG -272 -336 V-
FLAG -304 -352 0
FLAG -272 -64 V+
FLAG -272 0 V-
FLAG -304 -16 0
FLAG -272 256 V+
FLAG -272 320 V-
FLAG -304 304 0
FLAG -272 592 V+
FLAG -272 656 V-
FLAG -304 640 0
FLAG -1200 -2064 0
FLAG -1088 -2064 0
FLAG -1088 -2144 V+
FLAG -1200 -2144 V-
FLAG -624 -1504 V+
FLAG -624 -1440 V-
FLAG -656 -1456 0
FLAG -624 -1872 V+
FLAG -624 -1808 V-
FLAG -656 -1824 0
FLAG -608 -1120 V+
FLAG -608 -1056 V-
FLAG -640 -1072 0
FLAG -608 -80 V+
FLAG -608 -16 V-
FLAG -640 -32 0
FLAG -608 -416 V+
FLAG -608 -352 V-
FLAG -640 -368 0
FLAG -608 -768 V+
FLAG -608 -704 V-
FLAG -640 -720 0
FLAG -608 576 V+
FLAG -608 640 V-
FLAG -640 624 0
FLAG -608 240 V+
FLAG -608 304 V-
FLAG -640 288 0
FLAG -912 -1856 AudioIn
IOPIN -912 -1856 In
FLAG -912 -752 AudioIn
IOPIN -912 -752 In
FLAG -912 -1488 AudioIn
IOPIN -912 -1488 In
FLAG -912 -400 AudioIn
IOPIN -912 -400 In
FLAG -912 -1104 AudioIn
IOPIN -912 -1104 In
FLAG -912 256 AudioIn
IOPIN -912 256 In
FLAG -912 -64 AudioIn
IOPIN -912 -64 In
FLAG -912 592 AudioIn
IOPIN -912 592 In
FLAG -816 -320 0
FLAG -816 -1776 0
FLAG -816 672 0
FLAG -816 -1408 0
FLAG -816 -1024 0
FLAG -816 -672 0
FLAG -816 16 0
FLAG -816 336 0
SYMBOL Opamps\\OP07 -288 -1888 R0
SYMATTR InstName U9
SYMBOL res -384 -1856 R90
WINDOW 0 0 56 VBottom 2
WINDOW 3 32 56 VTop 2
SYMATTR InstName R21
SYMATTR Value 10000.000
SYMBOL res -192 -1952 R90
WINDOW 0 0 56 VBottom 2
WINDOW 3 32 56 VTop 2
SYMATTR InstName R22
SYMATTR Value 185000
SYMBOL Opamps\\OP07 -304 -1520 R0
SYMATTR InstName U2
SYMBOL res -384 -1488 R90
WINDOW 0 0 56 VBottom 2
WINDOW 3 32 56 VTop 2
SYMATTR InstName R3
SYMATTR Value 10000.000
SYMBOL res -192 -1584 R90
WINDOW 0 0 56 VBottom 2
WINDOW 3 32 56 VTop 2
SYMATTR InstName R4
SYMATTR Value 110000
SYMBOL Opamps\\OP07 -272 -1136 R0
SYMATTR InstName U7
SYMBOL res -368 -1104 R90
WINDOW 0 0 56 VBottom 2
WINDOW 3 32 56 VTop 2
SYMATTR InstName R5
SYMATTR Value 10000.000
SYMBOL res -192 -1200 R90
WINDOW 0 0 56 VBottom 2
WINDOW 3 32 56 VTop 2
SYMATTR InstName R6
SYMATTR Value 45000
SYMBOL Opamps\\OP07 -272 -784 R0
SYMATTR InstName U13
SYMBOL res -368 -752 R90
WINDOW 0 0 56 VBottom 2
WINDOW 3 32 56 VTop 2
SYMATTR InstName R7
SYMATTR Value 10000.000
SYMBOL res -192 -848 R90
WINDOW 0 0 56 VBottom 2
WINDOW 3 32 56 VTop 2
SYMATTR InstName R8
SYMATTR Value 65000
SYMBOL Opamps\\OP07 -272 -432 R0
SYMATTR InstName U19
SYMBOL res -368 -400 R90
WINDOW 0 0 56 VBottom 2
WINDOW 3 32 56 VTop 2
SYMATTR InstName R17
SYMATTR Value 10000.000
SYMBOL res -192 -496 R90
WINDOW 0 0 56 VBottom 2
WINDOW 3 32 56 VTop 2
SYMATTR InstName R18
SYMATTR Value 60000
SYMBOL Opamps\\OP07 -272 -96 R0
SYMATTR InstName U23
SYMBOL res -368 -64 R90
WINDOW 0 0 56 VBottom 2
WINDOW 3 32 56 VTop 2
SYMATTR InstName R29
SYMATTR Value 10000.000
SYMBOL res -192 -160 R90
WINDOW 0 0 56 VBottom 2
WINDOW 3 32 56 VTop 2
SYMATTR InstName R30
SYMATTR Value 250000
SYMBOL Opamps\\OP07 -272 224 R0
SYMATTR InstName U25
SYMBOL res -368 256 R90
WINDOW 0 0 56 VBottom 2
WINDOW 3 32 56 VTop 2
SYMATTR InstName R41
SYMATTR Value 10000.000
SYMBOL res -192 160 R90
WINDOW 0 0 56 VBottom 2
WINDOW 3 32 56 VTop 2
SYMATTR InstName R42
SYMATTR Value 375000
SYMBOL Opamps\\OP07 -272 560 R0
SYMATTR InstName U27
SYMBOL res -368 592 R90
WINDOW 0 0 56 VBottom 2
WINDOW 3 32 56 VTop 2
SYMATTR InstName R49
SYMATTR Value 10000.000
SYMBOL res -208 496 R90
WINDOW 0 0 56 VBottom 2
WINDOW 3 32 56 VTop 2
SYMATTR InstName R50
SYMATTR Value 460000
SYMBOL voltage -1088 -2160 R0
WINDOW 123 0 0 Left 2
WINDOW 39 0 0 Left 2
SYMATTR InstName V1
SYMATTR Value 12
SYMBOL voltage -1200 -2160 R0
WINDOW 123 0 0 Left 2
WINDOW 39 0 0 Left 2
SYMATTR InstName V2
SYMATTR Value -12
SYMBOL Opamps\\OP07 -624 -1536 R0
SYMATTR InstName U1
SYMBOL res -816 -1504 R90
WINDOW 0 0 56 VBottom 2
WINDOW 3 32 56 VTop 2
SYMATTR InstName R1
SYMATTR Value 10825.318
SYMBOL cap -704 -1504 R90
WINDOW 0 0 32 VBottom 2
WINDOW 3 32 32 VTop 2
SYMATTR InstName C1
SYMATTR Value 45.944n
SYMBOL cap -640 -1664 R90
WINDOW 0 0 32 VBottom 2
WINDOW 3 32 32 VTop 2
SYMATTR InstName C2
SYMATTR Value 45.944n
SYMBOL res -576 -1584 R90
WINDOW 0 0 56 VBottom 2
WINDOW 3 32 56 VTop 2
SYMATTR InstName R2
SYMATTR Value 69282.032
SYMBOL Opamps\\OP07 -624 -1904 R0
SYMATTR InstName U3
SYMBOL res -816 -1872 R90
WINDOW 0 0 56 VBottom 2
WINDOW 3 32 56 VTop 2
SYMATTR InstName R9
SYMATTR Value 4002.715
SYMBOL cap -704 -1872 R90
WINDOW 0 0 32 VBottom 2
WINDOW 3 32 32 VTop 2
SYMATTR InstName C3
SYMATTR Value 155.319n
SYMBOL cap -640 -2032 R90
WINDOW 0 0 32 VBottom 2
WINDOW 3 32 32 VTop 2
SYMATTR InstName C4
SYMATTR Value 155.319n
SYMBOL res -576 -1952 R90
WINDOW 0 0 56 VBottom 2
WINDOW 3 32 56 VTop 2
SYMATTR InstName R10
SYMATTR Value 25617.377
SYMBOL Opamps\\OP07 -608 -1152 R0
SYMATTR InstName U4
SYMBOL res -816 -1120 R90
WINDOW 0 0 56 VBottom 2
WINDOW 3 32 56 VTop 2
SYMATTR InstName R11
SYMATTR Value 7654.655
SYMBOL cap -688 -1120 R90
WINDOW 0 0 32 VBottom 2
WINDOW 3 32 32 VTop 2
SYMATTR InstName C5
SYMATTR Value 32.487n
SYMBOL cap -624 -1280 R90
WINDOW 0 0 32 VBottom 2
WINDOW 3 32 32 VTop 2
SYMATTR InstName C6
SYMATTR Value 32.487n
SYMBOL res -560 -1200 R90
WINDOW 0 0 56 VBottom 2
WINDOW 3 32 56 VTop 2
SYMATTR InstName R12
SYMATTR Value 48989.795
SYMBOL Opamps\\OP07 -608 -112 R0
SYMATTR InstName U5
SYMBOL res -816 -80 R90
WINDOW 0 0 56 VBottom 2
WINDOW 3 32 56 VTop 2
SYMATTR InstName R13
SYMATTR Value 17116.330
SYMBOL cap -688 -80 R90
WINDOW 0 0 32 VBottom 2
WINDOW 3 32 32 VTop 2
SYMATTR InstName C7
SYMATTR Value 5.812n
SYMBOL cap -624 -240 R90
WINDOW 0 0 32 VBottom 2
WINDOW 3 32 32 VTop 2
SYMATTR InstName C8
SYMATTR Value 5.812n
SYMBOL res -560 -160 R90
WINDOW 0 0 56 VBottom 2
WINDOW 3 32 56 VTop 2
SYMATTR InstName R14
SYMATTR Value 109544.512
SYMBOL Opamps\\OP07 -608 -448 R0
SYMATTR InstName U6
SYMBOL res -816 -416 R90
WINDOW 0 0 56 VBottom 2
WINDOW 3 32 56 VTop 2
SYMATTR InstName R15
SYMATTR Value 4419.417
SYMBOL cap -688 -416 R90
WINDOW 0 0 32 VBottom 2
WINDOW 3 32 32 VTop 2
SYMATTR InstName C9
SYMATTR Value 11.254n
SYMBOL cap -624 -576 R90
WINDOW 0 0 32 VBottom 2
WINDOW 3 32 32 VTop 2
SYMATTR InstName C10
SYMATTR Value 11.254n
SYMBOL res -560 -496 R90
WINDOW 0 0 56 VBottom 2
WINDOW 3 32 56 VTop 2
SYMATTR InstName R16
SYMATTR Value 28284.271
SYMBOL Opamps\\OP07 -608 -800 R0
SYMATTR InstName U8
SYMBOL res -816 -768 R90
WINDOW 0 0 56 VBottom 2
WINDOW 3 32 56 VTop 2
SYMATTR InstName R19
SYMATTR Value 23385.359
SYMBOL cap -688 -768 R90
WINDOW 0 0 32 VBottom 2
WINDOW 3 32 32 VTop 2
SYMATTR InstName C11
SYMATTR Value 21.268n
SYMBOL cap -624 -928 R90
WINDOW 0 0 32 VBottom 2
WINDOW 3 32 32 VTop 2
SYMATTR InstName C12
SYMATTR Value 21.268n
SYMBOL res -560 -848 R90
WINDOW 0 0 56 VBottom 2
WINDOW 3 32 56 VTop 2
SYMATTR InstName R20
SYMATTR Value 149666.295
SYMBOL Opamps\\OP07 -608 544 R0
SYMATTR InstName U10
SYMBOL res -816 576 R90
WINDOW 0 0 56 VBottom 2
WINDOW 3 32 56 VTop 2
SYMATTR InstName R23
SYMATTR Value 13975.425
SYMBOL cap -688 576 R90
WINDOW 0 0 32 VBottom 2
WINDOW 3 32 32 VTop 2
SYMATTR InstName C13
SYMATTR Value 3.559n
SYMBOL cap -624 416 R90
WINDOW 0 0 32 VBottom 2
WINDOW 3 32 32 VTop 2
SYMATTR InstName C14
SYMATTR Value 3.559n
SYMBOL res -560 496 R90
WINDOW 0 0 56 VBottom 2
WINDOW 3 32 56 VTop 2
SYMATTR InstName R24
SYMATTR Value 89442.719
SYMBOL Opamps\\OP07 -608 208 R0
SYMATTR InstName U11
SYMBOL res -816 240 R90
WINDOW 0 0 56 VBottom 2
WINDOW 3 32 56 VTop 2
SYMATTR InstName R25
SYMATTR Value 23385.359
SYMBOL cap -688 240 R90
WINDOW 0 0 32 VBottom 2
WINDOW 3 32 32 VTop 2
SYMATTR InstName C15
SYMATTR Value 4.254n
SYMBOL cap -624 80 R90
WINDOW 0 0 32 VBottom 2
WINDOW 3 32 32 VTop 2
SYMATTR InstName C16
SYMATTR Value 4.254n
SYMBOL res -560 160 R90
WINDOW 0 0 56 VBottom 2
WINDOW 3 32 56 VTop 2
SYMATTR InstName R26
SYMATTR Value 149666.295
SYMBOL res -832 -416 R0
SYMATTR InstName R27
SYMATTR Value 17677.670
SYMBOL res -832 -1872 R0
SYMATTR InstName R28
SYMATTR Value 157645.396
SYMBOL res -832 -1504 R0
SYMATTR InstName R31
SYMATTR Value 1665.433
SYMBOL res -832 -1120 R0
SYMATTR InstName R32
SYMATTR Value 2783.511
SYMBOL res -832 -768 R0
SYMATTR InstName R33
SYMATTR Value 687.805
SYMBOL res -832 240 R0
SYMATTR InstName R34
SYMATTR Value 687.805
SYMBOL res -832 576 R0
SYMATTR InstName R35
SYMATTR Value 1215.254
SYMBOL res -832 -80 R0
SYMATTR InstName R36
SYMATTR Value 964.300
TEXT -544 -968 Left 2 ;950-1500
TEXT -536 -616 Left 2 ;1500-1800
TEXT -536 -280 Left 2 ;2200-2500
TEXT -536 40 Left 2 ;2500-3500
TEXT -544 376 Left 2 ;3500-4500
TEXT -808 -1704 Left 2 ;100-150
TEXT -760 -2072 Left 2 ;50-70
TEXT -744 -1320 Left 2 ;200-500
TEXT -744 -280 Left 2 ;1500-2000
TEXT -744 -616 Left 2 ;500-2000
TEXT -744 -968 Left 2 ;500-1000
TEXT -744 376 Left 2 ;2500-5000
TEXT -744 40 Left 2 ;2250-2750
TEXT -624 -2080 Left 2 ;110-210
TEXT -616 -1712 Left 2 ;290-580
TEXT -608 -1320 Left 2 ;600-900
RECTANGLE Normal -96 -2128 -944 720 1

bidirectionlamp.asc, the sub-circuit schematic file:
Version 4
SHEET 1 3500 692
WIRE 1280 -1504 1264 -1504
WIRE 1376 -1504 1360 -1504
WIRE 1376 -1408 1376 -1504
WIRE 1376 -1408 1360 -1408
WIRE 1424 -1408 1376 -1408
WIRE 1568 -1408 1504 -1408
WIRE 1232 -1392 1184 -1392
WIRE 1264 -1392 1264 -1504
WIRE 1264 -1392 1232 -1392
WIRE 1296 -1392 1264 -1392
WIRE 1376 -1376 1360 -1376
WIRE 1376 -1360 1376 -1376
WIRE 1184 -1264 1184 -1392
WIRE 1392 -1264 1344 -1264
WIRE 1520 -1264 1472 -1264
WIRE 1696 -1248 1664 -1248
WIRE 1824 -1248 1776 -1248
WIRE 2192 -1168 2160 -1168
WIRE 2320 -1168 2272 -1168
WIRE 2496 -1152 2464 -1152
WIRE 2624 -1152 2576 -1152
WIRE 1184 -1136 1184 -1200
WIRE 1184 -1136 992 -1136
WIRE 1344 -1136 1344 -1264
WIRE 1344 -1136 1184 -1136
WIRE 1408 -1136 1344 -1136
WIRE 1520 -1120 1520 -1264
WIRE 1520 -1120 1472 -1120
WIRE 1568 -1120 1520 -1120
WIRE 1664 -1120 1664 -1248
WIRE 1664 -1120 1648 -1120
WIRE 1712 -1120 1664 -1120
WIRE 1824 -1104 1824 -1248
WIRE 1824 -1104 1776 -1104
WIRE 1936 -1104 1824 -1104
WIRE 2016 -1104 2000 -1104
WIRE 2128 -1104 2096 -1104
WIRE 2128 -1056 2128 -1104
WIRE 2160 -1056 2160 -1168
WIRE 2160 -1056 2128 -1056
WIRE 2208 -1056 2160 -1056
WIRE 2320 -1040 2320 -1168
WIRE 2320 -1040 2272 -1040
WIRE 2384 -1040 2320 -1040
WIRE 2464 -1040 2464 -1152
WIRE 2512 -1040 2464 -1040
WIRE 2624 -1024 2624 -1152
WIRE 2624 -1024 2576 -1024
WIRE 2688 -1024 2624 -1024
WIRE 2016 -992 2000 -992
WIRE 2128 -992 2128 -1056
WIRE 2128 -992 2096 -992
WIRE 2128 -960 2128 -992
WIRE 1968 -864 1952 -864
WIRE 2128 -864 2128 -880
WIRE 2128 -864 2048 -864
WIRE 1952 -768 1952 -864
WIRE 2016 -768 1952 -768
WIRE 2128 -752 2128 -864
WIRE 2128 -752 2080 -752
FLAG 992 -1136 INOUT
FLAG 2688 -1024 NeuronIN
FLAG 1568 -1408 NeuronOUT
FLAG 1104 -848 0
FLAG 1200 -848 0
FLAG 1104 -928 V12+
FLAG 1200 -928 V12-
FLAG 1328 -1360 V12-
FLAG 1328 -1424 V12+
FLAG 1376 -1360 0
FLAG 1440 -1088 V12-
FLAG 1440 -1152 V12+
FLAG 2208 -1024 0
FLAG 2512 -1008 0
FLAG 2240 -1072 V12+
FLAG 2544 -1056 V12+
FLAG 2240 -1008 V12-
FLAG 2544 -992 V12-
FLAG 1232 -1312 0
FLAG 1408 -1104 0
FLAG 1520 -1040 0
FLAG 1712 -1088 0
FLAG 1824 -1024 0
FLAG 2320 -960 0
FLAG 1744 -1136 V12+
FLAG 1744 -1072 V12-
FLAG 2048 -720 V12-
FLAG 2048 -784 V12+
FLAG 2016 -736 0
FLAG 1936 -992 Label
IOPIN 1936 -992 In
FLAG 1872 -768 Label2
IOPIN 1872 -768 In
SYMBOL voltage 1104 -944 R0
WINDOW 123 0 0 Left 2
WINDOW 39 0 0 Left 2
SYMATTR InstName V3
SYMATTR Value 12
SYMBOL voltage 1200 -944 R0
WINDOW 123 0 0 Left 2
WINDOW 39 0 0 Left 2
SYMATTR InstName V4
SYMATTR Value -12
SYMBOL Opamps\\UniversalOpamp2 1328 -1392 M0
SYMATTR InstName U10
SYMBOL res 1264 -1520 M90
WINDOW 0 0 56 VBottom 2
WINDOW 3 -16 22 VTop 2
SYMATTR InstName R13
SYMATTR Value 20k
SYMBOL res 1408 -1424 M90
WINDOW 0 0 56 VBottom 2
WINDOW 3 32 56 VTop 2
SYMATTR InstName R14
SYMATTR Value 1k
SYMBOL Opamps\\UniversalOpamp2 1440 -1120 R0
SYMATTR InstName U11
SYMBOL diode 1200 -1200 R180
WINDOW 0 24 64 Left 2
WINDOW 3 24 0 Left 2
SYMATTR InstName D2
SYMBOL diode 1936 -1088 R270
WINDOW 0 32 32 VTop 2
WINDOW 3 0 32 VBottom 2
SYMATTR InstName D3
SYMBOL Opamps\\OP07 2240 -1104 R0
SYMATTR InstName U13
SYMBOL res 2112 -1120 R90
WINDOW 0 0 56 VBottom 2
WINDOW 3 32 56 VTop 2
SYMATTR InstName R15
SYMATTR Value 1.75k
SYMBOL res 2112 -1008 R90
WINDOW 0 0 56 VBottom 2
WINDOW 3 32 56 VTop 2
SYMATTR InstName R16
SYMATTR Value 1.2k
SYMBOL res 2288 -1184 R90
WINDOW 0 0 56 VBottom 2
WINDOW 3 32 56 VTop 2
SYMATTR InstName R19
SYMATTR Value 1.5k
SYMBOL Opamps\\OP07 2544 -1088 R0
SYMATTR InstName U14
SYMBOL res 2592 -1168 R90
WINDOW 0 0 56 VBottom 2
WINDOW 3 32 56 VTop 2
SYMATTR InstName R20
SYMATTR Value 10k
SYMBOL res 2480 -1056 R90
WINDOW 0 0 56 VBottom 2
WINDOW 3 32 56 VTop 2
SYMATTR InstName R22
SYMATTR Value 10k
SYMBOL diode 1936 -976 R270
WINDOW 0 32 32 VTop 2
WINDOW 3 0 32 VBottom 2
SYMATTR InstName D4
SYMBOL res 1216 -1408 R0
SYMATTR InstName R23
SYMATTR Value 10k
SYMBOL res 1504 -1136 R0
SYMATTR InstName R24
SYMATTR Value 10k
SYMBOL res 1488 -1280 R90
WINDOW 0 0 56 VBottom 2
WINDOW 3 32 56 VTop 2
SYMATTR InstName R25
SYMATTR Value 100k
SYMBOL Opamps\\UniversalOpamp2 1744 -1104 R0
SYMATTR InstName U16
SYMBOL res 1808 -1120 R0
SYMATTR InstName R26
SYMATTR Value 10k
SYMBOL res 1792 -1264 R90
WINDOW 0 0 56 VBottom 2
WINDOW 3 32 56 VTop 2
SYMATTR InstName R27
SYMATTR Value 100k
SYMBOL res 1664 -1136 R90
WINDOW 0 0 56 VBottom 2
WINDOW 3 32 56 VTop 2
SYMATTR InstName R28
SYMATTR Value 125
SYMBOL res 2304 -1056 R0
SYMATTR InstName R29
SYMATTR Value 10k
SYMBOL Opamps\\UniversalOpamp2 2048 -752 R0
SYMATTR InstName U19
SYMBOL res 1968 -784 R90
WINDOW 0 0 56 VBottom 2
WINDOW 3 32 56 VTop 2
SYMATTR InstName R30
SYMATTR Value 1k
SYMBOL res 2064 -880 R90
WINDOW 0 0 56 VBottom 2
WINDOW 3 32 56 VTop 2
SYMATTR InstName R31
SYMATTR Value 3k
SYMBOL res 2112 -976 R0
SYMATTR InstName R32
SYMATTR Value 1k

The netlist it stands for:
* Net Array_Small.asc
XX2 N005 N004 NC_01 synapse
XX3 N003 N004 NC_02 ahp params: AHP Rinhibition = 1Meg
XX17 N005 N018 NC_03 synapse
XX18 N017 N018 NC_04 ahp params: AHP Rinhibition = 1Meg
XX20 N006 N004 NC_05 synapse
XX27 N006 N018 NC_06 synapse
XX11 Label Label2 outputlabels
V§AudioTrain N011 N014 wavefile=V_train.wav
V§AudioTest N014 0 wavefile=V_test.wav
XX12 N001 N003 N007 N009 N012 N015 N017 N019 N011 filterbank
V1 V+ 0 12
V2 V- 0 -12
R14 predict 0 50k
C1 predict 0 5µ
XU2 N021 N029 V+ V- N026 LT1001  ; OP07, pins In+ In- V+ V- OUT
D2 N026 N025 D
R18 N025 predict 10k
XX1 N005 N002 NC_07 synapse
XX4 N001 N002 NC_08 ahp params: AHP Rinhibition = 1Meg
XX5 N006 N002 NC_09 synapse
XX6 N005 N008 NC_10 synapse
XX7 N007 N008 NC_11 ahp params: AHP Rinhibition = 1Meg
XX9 N006 N008 NC_12 synapse
XX10 N005 N010 NC_13 synapse
XX13 N009 N010 NC_14 ahp params: AHP Rinhibition = 1Meg
XX14 N006 N010 NC_15 synapse
XX15 N005 N013 NC_16 synapse
XX16 N012 N013 NC_17 ahp params: AHP Rinhibition = 1Meg
XX19 N006 N013 NC_18 synapse
XX21 N005 N016 NC_19 synapse
XX22 N015 N016 NC_20 ahp params: AHP Rinhibition = 1Meg
XX23 N006 N016 NC_21 synapse
XX24 N005 N020 NC_22 synapse
XX25 N019 N020 NC_23 ahp params: AHP Rinhibition = 1Meg
XX26 N006 N020 NC_24 synapse
R36 N029 0 1k
R37 N029 N026 100k
R15 predict2 0 50k
C2 predict2 0 5µ
XU1 N024 N030 V+ V- N027 LT1001  ; OP07, pins In+ In- V+ V- OUT
D1 N027 N028 D
R16 N028 predict2 10k
R55 N030 0 1k
R56 N030 N027 100k
XX8 N006 N023 N024 Label2 Label bidirectionlamp
XX29 N022 N021 NC_25 ahp params: AHP Rinhibition = 1Meg
XX30 N023 N024 NC_26 ahp params: AHP Rinhibition = 1Meg
XX28 N005 N022 N021 Label Label2 bidirectionlamp

* block symbol definitions
.subckt synapse Vpre Vpost Vmem
R6 0 Vin 10K
B4 Vspk 0 V=2*(v(Vpost)-v(Vpre))
R8 Vpost Vpre R=1/(v(Vmem)+0.0005)*6426871-691000
C3 Vin 0 .1µ V=16 Irms=7.41 Rser=0.000 Lser=0
D2 Vspk N001 OGN4148
R2 Vin N001 10K
B1 N004 0 V=abs(v(Vspk))
C1 Vmem 0 0.8n V=16 Irms=7.41 Rser=0.000 Lser=0
R3 0 Vmem 10000Meg
R4 Vmem N003 50Meg
B3 N002 0 V=0.14 * exp(0.9*v(Vin))
M1 Vmem N005 P001 P001 NMOS
R5 P001 0 20Meg
C2 N005 N004 0.1n
R7 N005 0 50k
D6 N002 N003 D
.model OGN4148 D(Is=4.5e-20 Rs=.568 N=1.752 Cjo=4p M=.4 tt=20n Iave=200m Vpk=75 mfg=OnSemi type=silicon)
* potentiation rate
* depression rate
* Spike Induced Decay Rate
* Full Bridge Rectifier aka absolute value
* absolute value for behavioral sources does some funky stufff
.ends synapse

.subckt ahp Vin Vout 5V+
R1 N001 P001 100K
C1 N001 0 1n
C2 N002 N001 20n
V2 5V+ 0 5
M3 N005 N002 0 0 NMOS
M1 N003 N001 0 0 NMOS
M2 N002 N003 0 0 NMOS
M5 N003 N001 5V+ 5V+ PMOS
M6 N002 N003 5V+ 5V+ PMOS
D3 Vin P001 D
R4 N001 N005 1
R5 Vout 0 50k
C3 Vout 0 50n
R6 N004 Vout 500
D1 N002 N004 D
R7 N001 0 1Meg
.ends ahp

.subckt outputlabels VL0 VL1
V0 VL0 0 PWL( 0.000 0 0.005 0 0.015 3 0.922 3 0.932 0 1.107 0 1.121 0 1.131 0 1.985 0 1.995 0 2.295 0 2.299 0 2.309 3 3.095 3 3.105 0 3.233 0 3.240 0 3.250 0 4.128 0 4.138 0 4.172 0 4.191 0 4.201 3 5.070 3 5.080 0 5.239 0 5.244 0 5.254 0 6.105 0 6.115 0 6.496 0 6.506 0)
V1 VL1 0 PWL( 0.000 0 0.005 0 0.015 0 0.922 0 0.932 0 1.107 0 1.121 0 1.131 3 1.985 3 1.995 0 2.295 0 2.299 0 2.309 0 3.095 0 3.105 0 3.233 0 3.240 0 3.250 3 4.128 3 4.138 0 4.172 0 4.191 0 4.201 0 5.070 0 5.080 0 5.239 0 5.244 0 5.254 3 6.105 3 6.115 0 6.496 0 6.506 0)
V2 VL2 0 PWL( 0.000 0 0.005 0 0.015 3 0.922 3 0.932 0 1.107 0 1.121 0 1.131 0 1.985 0 1.995 0 2.295 0 2.299 0 2.309 3 3.095 3 3.105 0 3.233 0 3.240 0 3.250 0 4.128 0 4.138 0 4.172 0 4.191 0 4.201 3 5.070 3 5.080 0 5.239 0 5.244 0 5.254 0 6.105 0 6.115 0 6.496 0 6.506 0)
V3 VL3 0 PWL( 0.000 0 0.005 0 0.015 0 0.922 0 0.932 0 1.107 0 1.121 0 1.131 3 1.985 3 1.995 0 2.295 0 2.299 0 2.309 0 3.095 0 3.105 0 3.233 0 3.240 0 3.250 3 4.128 3 4.138 0 4.172 0 4.191 0 4.201 0 5.070 0 5.080 0 5.239 0 5.244 0 5.254 3 6.105 3 6.115 0 6.496 0 6.506 0)
V4 VL4 0 PWL( 0.000 0 0.005 0 0.015 3 0.922 3 0.932 0 1.107 0 1.121 0 1.131 0 1.985 0 1.995 0 2.295 0 2.299 0 2.309 3 3.095 3 3.105 0 3.233 0 3.240 0 3.250 0 4.128 0 4.138 0 4.172 0 4.191 0 4.201 3 5.070 3 5.080 0 5.239 0 5.244 0 5.254 0 6.105 0 6.115 0 6.496 0 6.506 0)
V5 VL5 0 PWL( 0.000 0 0.005 0 0.015 0 0.922 0 0.932 0 1.107 0 1.121 0 1.131 3 1.985 3 1.995 0 2.295 0 2.299 0 2.309 0 3.095 0 3.105 0 3.233 0 3.240 0 3.250 3 4.128 3 4.138 0 4.172 0 4.191 0 4.201 0 5.070 0 5.080 0 5.239 0 5.244 0 5.254 3 6.105 3 6.115 0 6.496 0 6.506 0)
V6 VL6 0 PWL( 0.000 0 0.005 0 0.015 3 0.922 3 0.932 0 1.107 0 1.121 0 1.131 0 1.985 0 1.995 0 2.295 0 2.299 0 2.309 3 3.095 3 3.105 0 3.233 0 3.240 0 3.250 0 4.128 0 4.138 0 4.172 0 4.191 0 4.201 3 5.070 3 5.080 0 5.239 0 5.244 0 5.254 0 6.105 0 6.115 0 6.496 0 6.506 0)
V7 VL7 0 PWL( 0.000 0 0.005 0 0.015 0 0.922 0 0.932 0 1.107 0 1.121 0 1.131 3 1.985 3 1.995 0 2.295 0 2.299 0 2.309 0 3.095 0 3.105 0 3.233 0 3.240 0 3.250 3 4.128 3 4.138 0 4.172 0 4.191 0 4.201 0 5.070 0 5.080 0 5.239 0 5.244 0 5.254 3 6.105 3 6.115 0 6.496 0 6.506 0)
.ends outputlabels

.subckt filterbank F1 F2 F3 F4 F5 F6 F7 F8 AudioIn
XU9 0 N004 V+ V- F1 LT1001  ; OP07, pins In+ In- V+ V- OUT
R21 N004 N002 10000.000
R22 F1 N004 185000
XU2 0 N008 V+ V- F2 LT1001  ; OP07, pins In+ In- V+ V- OUT
R3 N008 N006 10000.000
R4 F2 N008 110000
XU7 0 N012 V+ V- F3 LT1001  ; OP07, pins In+ In- V+ V- OUT
R5 N012 N010 10000.000
R6 F3 N012 45000
XU13 0 N016 V+ V- F4 LT1001  ; OP07, pins In+ In- V+ V- OUT
R7 N016 N014 10000.000
R8 F4 N016 65000
XU19 0 N020 V+ V- F5 LT1001  ; OP07, pins In+ In- V+ V- OUT
R17 N020 N018 10000.000
R18 F5 N020 60000
XU23 0 N024 V+ V- F6 LT1001  ; OP07, pins In+ In- V+ V- OUT
R29 N024 N022 10000.000
R30 F6 N024 250000
XU25 0 N028 V+ V- F7 LT1001  ; OP07, pins In+ In- V+ V- OUT
R41 N028 N026 10000.000
R42 F7 N028 375000
XU27 0 N032 V+ V- F8 LT1001  ; OP07, pins In+ In- V+ V- OUT
R49 N032 N030 10000.000
R50 F8 N032 460000
V1 V+ 0 12
V2 V- 0 -12
XU1 0 N007 V+ V- N006 LT1001  ; OP07, pins In+ In- V+ V- OUT
R1 N005 AudioIn 10825.318
C1 N007 N005 45.944n
C2 N006 N005 45.944n
R2 N006 N007 69282.032
XU3 0 N003 V+ V- N002 LT1001  ; OP07, pins In+ In- V+ V- OUT
R9 N001 AudioIn 4002.715
C3 N003 N001 155.319n
C4 N002 N001 155.319n
R10 N002 N003 25617.377
XU4 0 N011 V+ V- N010 LT1001  ; OP07, pins In+ In- V+ V- OUT
R11 N009 AudioIn 7654.655
C5 N011 N009 32.487n
C6 N010 N009 32.487n
R12 N010 N011 48989.795
XU5 0 N023 V+ V- N022 LT1001  ; OP07, pins In+ In- V+ V- OUT
R13 N021 AudioIn 17116.330
C7 N023 N021 5.812n
C8 N022 N021 5.812n
R14 N022 N023 109544.512
XU6 0 N019 V+ V- N018 LT1001  ; OP07, pins In+ In- V+ V- OUT
R15 N017 AudioIn 4419.417
C9 N019 N017 11.254n
C10 N018 N017 11.254n
R16 N018 N019 28284.271
XU8 0 N015 V+ V- N014 LT1001  ; OP07, pins In+ In- V+ V- OUT
R19 N013 AudioIn 23385.359
C11 N015 N013 21.268n
C12 N014 N013 21.268n
R20 N014 N015 149666.295
XU10 0 N031 V+ V- N030 LT1001  ; OP07, pins In+ In- V+ V- OUT
R23 N029 AudioIn 13975.425
C13 N031 N029 3.559n
C14 N030 N029 3.559n
R24 N030 N031 89442.719
XU11 0 N027 V+ V- N026 LT1001  ; OP07, pins In+ In- V+ V- OUT
R25 N025 AudioIn 23385.359
C15 N027 N025 4.254n
C16 N026 N025 4.254n
R26 N026 N027 149666.295
R27 N017 0 17677.670
R28 N001 0 157645.396
R31 N005 0 1665.433
R32 N009 0 2783.511
R33 N013 0 687.805
R34 N025 0 687.805
R35 N029 0 1215.254
R36 N021 0 964.300
* 950-1500
* 1500-1800
* 2200-2500
* 2500-3500
* 3500-4500
* 100-150
* 50-70
* 200-500
* 1500-2000
* 500-2000
* 500-1000
* 2500-5000
* 2250-2750
* 110-210
* 290-580
* 600-900
.ends filterbank

.subckt bidirectionlamp INOUT NeuronIN NeuronOUT Label Label2
V3 V12+ 0 12
V4 V12- 0 -12
XU10 0 N002 V12+ V12- N001 level.2 Avol=1Meg GBW=10Meg Slew=10Meg ilimit=25m rail=0 Vos=0 phimargin=45 en=0 enk=0 in=0 ink=0 Rin=500Meg  ; pins IN+ IN- V+ V- OUT
R13 N001 N002 20k
R14 N002 NeuronOUT 1k
XU11 0 INOUT V12+ V12- N003 level.2 Avol=1Meg GBW=10Meg Slew=10Meg ilimit=25m rail=0 Vos=0 phimargin=45 en=0 enk=0 in=0 ink=0 Rin=500Meg  ; pins IN+ IN- V+ V- OUT
D2 INOUT N001 D
D3 N005 N009 D
XU13 0 N006 V12+ V12- N007 LT1001  ; OP07, pins In+ In- V+ V- OUT
R15 N006 N009 1.75k
R16 N006 N010 1.2k
R19 N007 N006 1.5k
XU14 0 N008 V12+ V12- NeuronIN LT1001  ; OP07, pins In+ In- V+ V- OUT
R20 NeuronIN N008 10k
R22 N008 N007 10k
D4 Label N010 D
R23 N001 0 10k
R24 N003 0 10k
R25 N003 INOUT 100k
XU16 0 N004 V12+ V12- N005 level.2 Avol=1Meg GBW=10Meg Slew=10Meg ilimit=25m rail=0 Vos=0 phimargin=45 en=0 enk=0 in=0 ink=0 Rin=500Meg  ; pins IN+ IN- V+ V- OUT
R26 N005 0 10k
R27 N005 N004 100k
R28 N004 N003 125
R29 N007 0 10k
XU19 0 N011 V12+ V12- N012 level.2 Avol=1Meg GBW=10Meg Slew=10Meg ilimit=25m rail=0 Vos=0 phimargin=45 en=0 enk=0 in=0 ink=0 Rin=500Meg  ; pins IN+ IN- V+ V- OUT
R30 N011 Label2 1k
R31 N012 N011 3k
R32 N006 N012 1k
.ends bidirectionlamp

.model D D
.lib standard.dio
.model NMOS NMOS
.model PMOS PMOS
.lib standard.mos
.tran 16.5
.lib LTC.lib
.lib UniversalOpamps2.sub
.backanno
.end